# EAGLE design board (EAGLE 9.4.2)
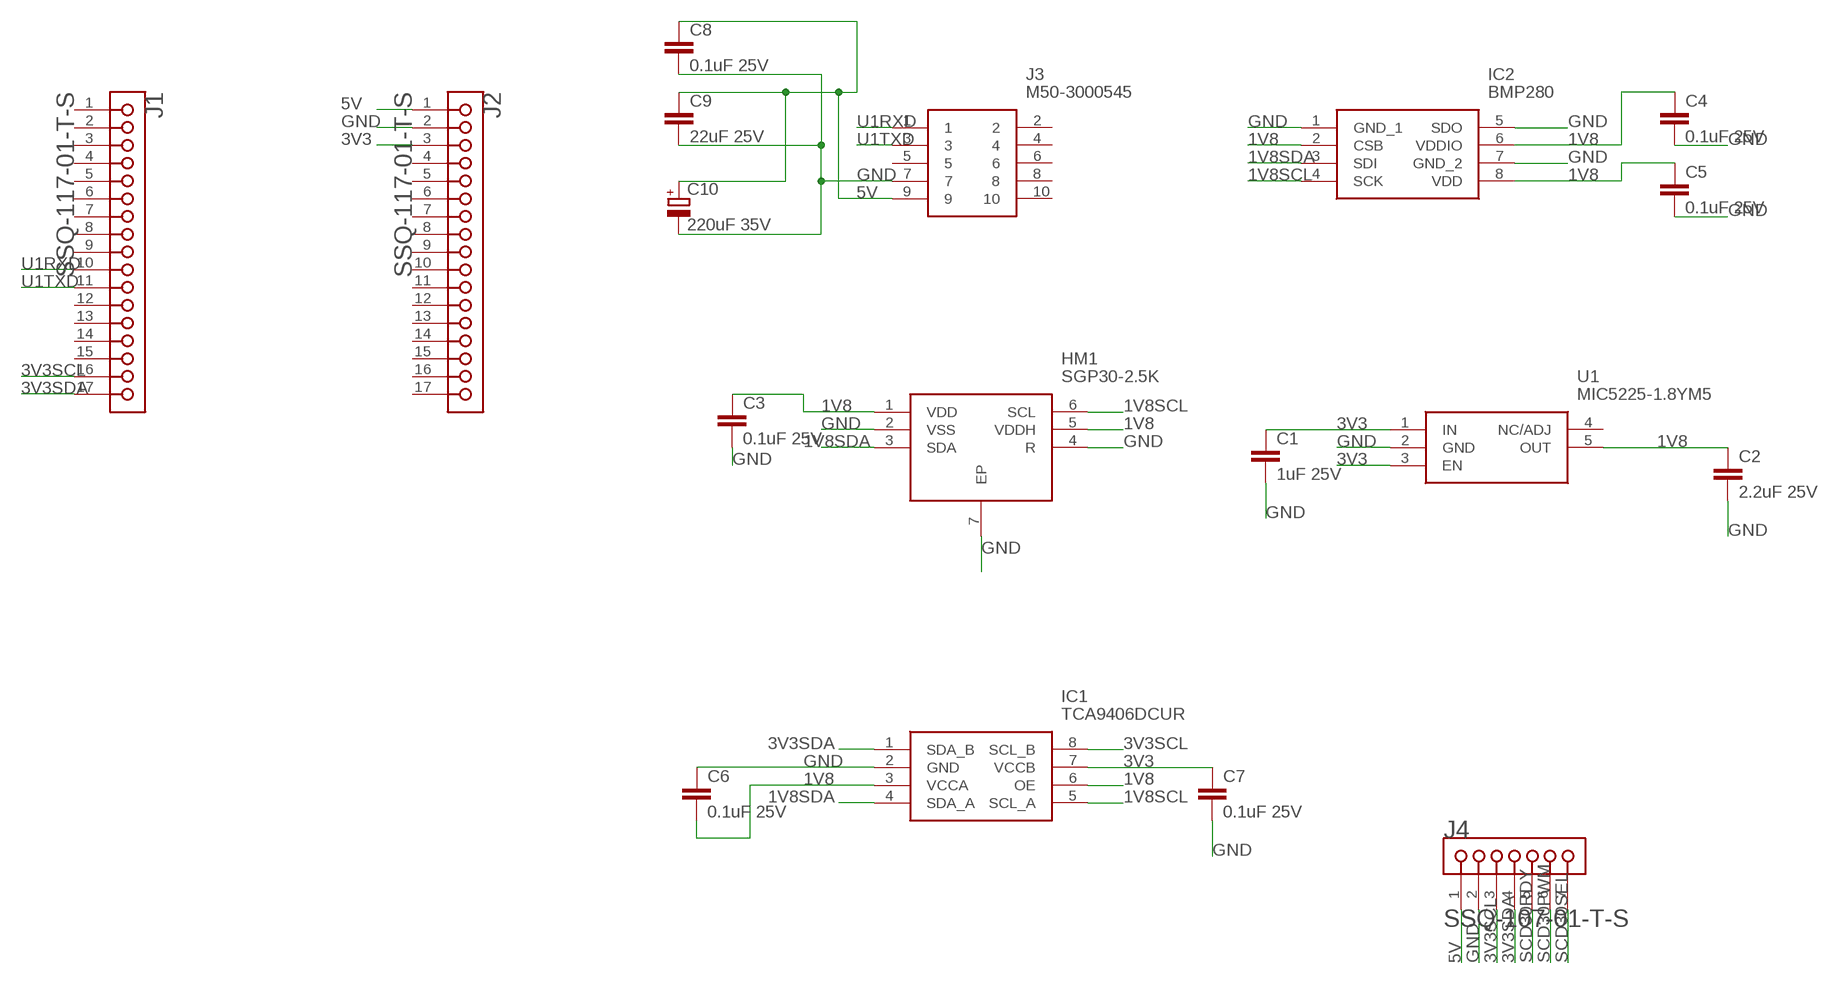
[diagram p0: schematic, sheet 1]

## Parts
C1  1uF 25V  C-EUC0402  [C0402]
C2  2.2uF 25V  C-EUC0402  [C0402]
C3  0.1uF 25V  C-EUC0402  [C0402]
C4  0.1uF 25V  C-EUC0402  [C0402]
C5  0.1uF 25V  C-EUC0402  [C0402]
C6  0.1uF 25V  C-EUC0402  [C0402]
C7  0.1uF 25V  C-EUC0402  [C0402]
C8  0.1uF 25V  C-EUC0402  [C0402]
C9  22uF 25V  C-EUC0805  [C0805]
C10  220uF 35V  CPOL-EUE5-10.5  [E5-10,5]
HM1  SGP30-2.5K  [SON80P245X245X90-7N]
IC1  TCA9406DCUR  [SOP50P310X90-8N]
IC2  BMP280  [8-PIN-METAL-LID-LGA_1]
J1  SAMTEC_SSQ-117-01-T-SSAMTEC_SSQ-117-01-T-S_0_0  [SAMTEC_SSQ-117-01-T-S_0]
J2  SAMTEC_SSQ-117-01-T-SSAMTEC_SSQ-117-01-T-S_0_0  [SAMTEC_SSQ-117-01-T-S_0]
J3  M50-3000545  [SHDR10W40P127X127_2X5_675X310X]
J4  SAMTEC_SSQ-107-01-T-SSAMTEC_SSQ-107-01-T-S_0_0  [SAMTEC_SSQ-107-01-T-S_0]
U1  MIC5225-1.8YM5  [SOT95P280X145-5N]

## Nets
1V8: C2.1 C3.1 C4.1 C5.1 C6.2 HM1.1(VDD) HM1.5(VDDH) IC1.3(VCCA) IC1.6(OE) IC2.2(CSB) IC2.6(VDDIO) IC2.8(VDD) U1.5(OUT)
1V8SCL: HM1.6(SCL) IC1.5(SCL_A) IC2.4(SCK)
1V8SDA: HM1.3(SDA) IC1.4(SDA_A) IC2.3(SDI)
3V3: C1.1 C7.1 IC1.7(VCCB) J2.3 U1.1(IN) U1.3(EN)
3V3SCL: IC1.8(SCL_B) J1.16 J4.3
3V3SDA: IC1.1(SDA_B) J1.17 J4.4
5V: C8.1 C9.1 C10.+ J2.1 J3.9 J4.1
GND: C1.2 C2.2 C3.2 C4.2 C5.2 C6.1 C7.2 C8.2 C9.2 C10.- HM1.2(VSS) HM1.4(R) HM1.7(EP) IC1.2(GND) IC2.1(GND_1) IC2.5(SDO) IC2.7(GND_2) J2.2 J3.7 J4.2 U1.2(GND)
SCD30PWM: J4.6
SCD30RDY: J4.5
SCD30SEL: J4.7
U1RXD: J1.10 J3.1
U1TXD: J1.11 J3.3
Unconnected: J1.1 J1.2 J1.3 J1.4 J1.5 J1.6 J1.7 J1.8 J1.9 J1.12 J1.13 J1.14 J1.15 J2.4 J2.5 J2.6 J2.7 J2.8 J2.9 J2.10 J2.11 J2.12 J2.13 J2.14 J2.15 J2.16 J2.17 J3.2 J3.4 J3.5 J3.6 J3.8 J3.10 U1.4(NC/ADJ)

## Library data of the parts
C1-C9 = rcl:C-EU: CAPACITOR, European symbol; SPICEPREFIX: C
C10 = rcl:CPOL-EU: POLARIZED CAPACITOR, European symbol; SPICEPREFIX: C
HM1 = SamacSys_Parts:SGP30-2.5K: AIR QUALITY GAS SENSOR FOR VOC'S Source: Datasheet <https://www.sensirion.com/fileadmin/user_upload/customers/sensirion/Dokumente/0_Datasheets/Gas/Sensirion_Gas_Sensors_SGP30_Datasheet.pdf>; DESCRIPTION: AIR QUALITY GAS SENSOR FOR VOC'S; HEIGHT: 0.9mm; MANUFACTURER_NAME: Sensirion AG; MANUFACTURER_PART_NUMBER: SGP30-2.5K
IC1 = SamacSys_Parts:TCA9406DCUR: 2-Bit Bidirectional 1-MHz I2C Bus and SMBus Voltage-Level Shifter Source: Datasheet <http://www.ti.com/lit/ds/symlink/tca9406.pdf>; DESCRIPTION: 2-Bit Bidirectional 1-MHz I2C Bus and SMBus Voltage-Level Shifter; HEIGHT: 0.9mm; MANUFACTURER_NAME: Texas Instruments; MANUFACTURER_PART_NUMBER: TCA9406DCUR; MOUSER_PART_NUMBER: 595-TCA9406DCUR; MOUSER_PRICE-STOCK: https://www.mouser.com/Search/Refine.aspx?Keyword=595-TCA9406DCUR; RS_PART_NUMBER: 7300644P; RS_PRICE-STOCK: http://uk.rs-online.com/web/p/products/7300644P
IC2 = SamacSys_Parts:BMP280: Digital Pressure Sensor Source: Datasheet <https://ae-bst.resource.bosch.com/media/_tech/media/datasheets/BST-BMP280-DS001-19.pdf>; DESCRIPTION: Digital Pressure Sensor; HEIGHT: mm; MANUFACTURER_NAME: Bosch; MANUFACTURER_PART_NUMBER: BMP280; MOUSER_PART_NUMBER: 262-BMP280
J1 J2 = Samtec - SSQ-117-01-T-S:SAMTEC_SSQ-117-01-T-S: SMTC-SSQ-117-01-X-S; CIIVA_IDS: 677232; COMPONENT_LINK_1_DESCRIPTION: Manufacturer URL; COMPONENT_LINK_1_URL: http://www.samtec.com; COMPONENT_LINK_3_DESCRIPTION: Package Specification; COMPONENT_LINK_3_URL: http://www.samtec.com/documents/webfiles/cpdf/SSQ-1XX-XX-XXX-X-XX-XXX-XX-X-MKT.pdf; DATASHEET: http://www.samtec.com/documents/webfiles/pdf/SSQ_TH.PDF; DATASHEET_VERSION: F-214; FOOTPRINT_VARIANT_NAME_0: Manufacturer Recommended; IMPORTED: yes; IMPORTED_FROM: vault; IMPORT_TS: 1521843089; MF: Samtec; MOUNTING_TECHNOLOGY: Through-hole; MPN: SSQ-117-01-T-S; ORIENTATION: Vertical; PACKAGE: SSQ-117-01-X-S; PACKAGE_DESCRIPTION: Assembly, Socket Strip .025[0.64] SQ Tail; PACKAGE_VERSION: BD, 6/1987; PITCH: 2.54 mm; PREFIX: J; RELEASE_DATE: 1404374478; TEMPERATURE_RANGE: -55 to 105 degC; VAULT_GUID: 51F95605-9192-4547-9232-81F4C6069D77; VAULT_REVISION: 376056EE-73F5-4DE6-86FB-5D86034DD3DE
J3 = SamacSys_Parts:M50-3000545: 2x5way DIL PCT Vert Socket HARWIN 1.27mm Pitch 10 Way 2 Row Straight PCB Socket, Through Hole, Solder Termination Source: Datasheet <https://cdn.harwin.com/pdfs/M50-300.pdf>; ALLIED_NUMBER: R1052996; ALLIED_PRICE-STOCK: https://www.alliedelec.com/harwin-m50-3000545/R1052996/; DESCRIPTION: 2x5way DIL PCT Vert Socket HARWIN 1.27mm Pitch 10 Way 2 Row Straight PCB Socket, Through Hole, Solder Termination; HEIGHT: 4.55mm; MANUFACTURER_NAME: HARWIN; MANUFACTURER_PART_NUMBER: M50-3000545; MOUSER_PART_NUMBER: 855-M50-3000545; MOUSER_PRICE-STOCK: https://www.mouser.com/Search/Refine.aspx?Keyword=855-M50-3000545; RS_PART_NUMBER: 6810692P; RS_PRICE-STOCK: http://uk.rs-online.com/web/p/products/6810692P
J4 = Samtec - SSQ-107-01-T-S:SAMTEC_SSQ-107-01-T-S: SMTC-SSQ-107-01-X-S; CIIVA_IDS: 677242; COMPONENT_LINK_1_DESCRIPTION: Manufacturer URL; COMPONENT_LINK_1_URL: http://www.samtec.com; COMPONENT_LINK_3_DESCRIPTION: Package Specification; COMPONENT_LINK_3_URL: http://www.samtec.com/documents/webfiles/cpdf/SSQ-1XX-XX-XXX-X-XX-XXX-XX-X-MKT.pdf; DATASHEET: http://www.samtec.com/documents/webfiles/pdf/SSQ_TH.PDF; DATASHEET_VERSION: F-214; FOOTPRINT_VARIANT_NAME_0: Manufacturer Recommended; IMPORTED: yes; IMPORTED_FROM: vault; IMPORT_TS: 1521843739; MF: Samtec; MOUNTING_TECHNOLOGY: Through-hole; MPN: SSQ-107-01-T-S; ORIENTATION: Vertical; PACKAGE: SSQ-107-01-X-S; PACKAGE_DESCRIPTION: Assembly, Socket Strip .025[0.64] SQ Tail; PACKAGE_VERSION: BD, 6/1987; PITCH: 2.54 mm; PREFIX: J; RELEASE_DATE: 1404374450; TEMPERATURE_RANGE: -55 to 105 degC; VAULT_GUID: BEC2537B-EFAC-41A8-9E29-E20360AA1012; VAULT_REVISION: DFF8E92A-4A4C-49C4-BD9F-B28D4257A290
U1 = SamacSys_Parts:MIC5225-1.8YM5: Ultra-Low Quiescent Current 150mA uCap Low Dropout Regulator Source: Datasheet <http://www.mouser.com/ds/2/268/mic5225-1082288.pdf>; DESCRIPTION: Ultra-Low Quiescent Current 150mA uCap Low Dropout Regulator; HEIGHT: 1.45mm; MANUFACTURER_NAME: Micrel; MANUFACTURER_PART_NUMBER: MIC5225-1.8YM5

## Board
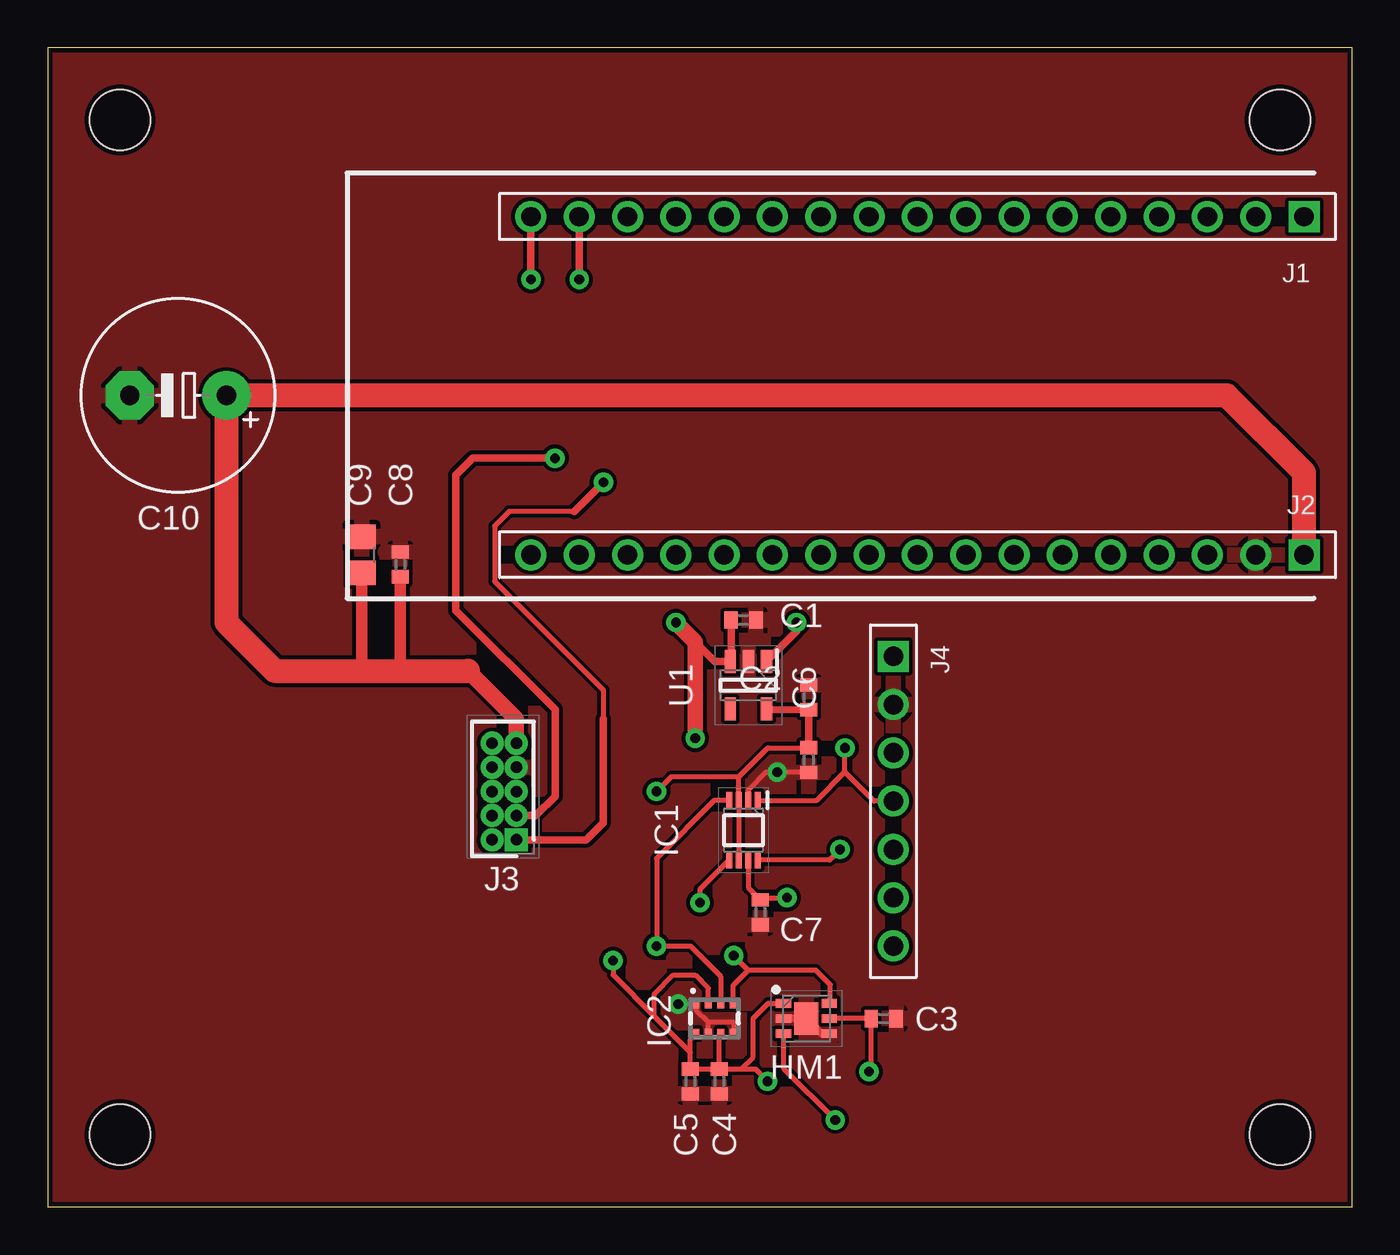
[diagram p1: board, top side]
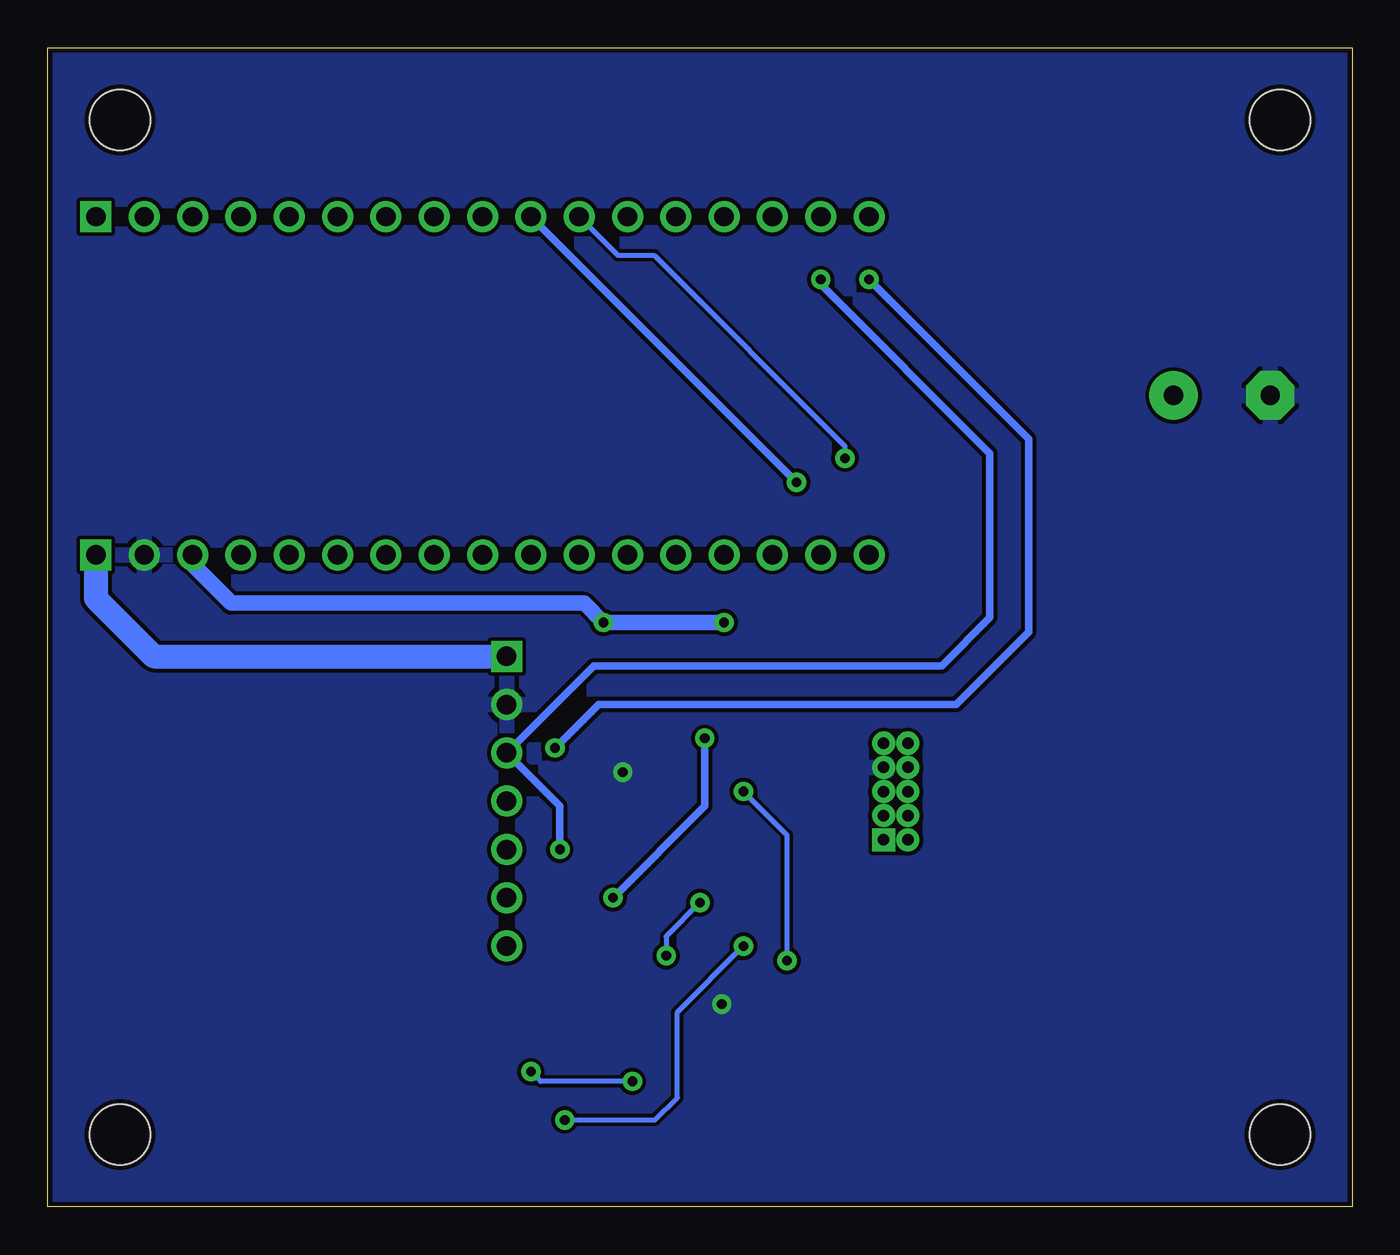
[diagram p2: board, bottom side, seen from below]

Size 68.58 x 60.96 mm. Coordinates in mm from the lower left corner, seen from the top.
Outline: 0,0 68.58,0 68.58,60.96 0,60.96 0,0
Copper layers (1*16): Top 0.035mm / dielectric 1.5mm / Bottom 0.035mm
Design rules "SparkFun": minimum track width 8mil, minimum drill 20mil, track to track 8mil, track to pad 8mil, pad to pad 8mil, via to via 8mil, smd to smd 8mil, copper to edge 10mil, drill to drill 8mil, minimum pad ring 12mil, minimum via ring 10mil, stop-mask expansion 4mil, vias tented up to drill 25mil, thermal gap 10mil
Holes 3.2 mm at 3.81,3.81 64.77,3.81 64.77,57.15 3.81,57.15

### Footprints (pad centres in the part's own frame; a part is rotated, then mirrored left to right if it is on the bottom)
C0402 = smd 0.7 x 0.9: 1 -0.65,0; 2 0.65,0
C0805 = smd 1.3 x 1.5: 1 -0.95,0; 2 0.95,0
E5-10,5 = drill 1.016 pad 2.54: + -2.54,0 | drill 1.016 pad 2.54 octagon: - 2.54,0
SON80P245X245X90-7N = smd 0.8 x 0.45: 1 -1.2,0.8; 2 -1.2,0; 3 -1.2,-0.8; 4 1.2,-0.8; 5 1.2,0; 6 1.2,0.8 | smd 1.25 x 1.7: 7 0,0
SOP50P310X90-8N = smd 0.85 x 0.3: 1 -1.575,0.75; 2 -1.575,0.25; 3 -1.575,-0.25; 4 -1.575,-0.75; 5 1.575,-0.75; 6 1.575,-0.25; 7 1.575,0.25; 8 1.575,0.75
8-PIN-METAL-LID-LGA_1 = smd 0.5 x 0.35: 1 0.8,0.975; 2 0.8,0.325; 3 0.8,-0.325; 4 0.8,-0.975; 5 -0.8,-0.975; 6 -0.8,-0.325; 7 -0.8,0.325; 8 -0.8,0.975
SAMTEC_SSQ-117-01-T-S_0 = drill 1.02 pad 1.55 square: 1 0,0 | drill 1.02 pad 1.55: 2 2.54,0; 3 5.08,0; 4 7.62,0; 5 10.16,0; 6 12.7,0; 7 15.24,0; 8 17.78,0; 9 20.32,0; 10 22.86,0; 11 25.4,0; 12 27.94,0; 13 30.48,0; 14 33.02,0; 15 35.56,0; 16 38.1,0; 17 40.64,0
SHDR10W40P127X127_2X5_675X310X = drill 0.6 pad 1 square: 1 0,0 | drill 0.6 pad 1: 2 0,1.27; 3 1.27,0; 4 1.27,1.27; 5 2.54,0; 6 2.54,1.27; 7 3.81,0; 8 3.81,1.27; 9 5.08,0; 10 5.08,1.27
SAMTEC_SSQ-107-01-T-S_0 = drill 1.02 pad 1.55 square: 1 0,0 | drill 1.02 pad 1.55: 2 2.54,0; 3 5.08,0; 4 7.62,0; 5 10.16,0; 6 12.7,0; 7 15.24,0
SOT95P280X145-5N = smd 1.2 x 0.6: 1 -1.25,0.95; 2 -1.25,0; 3 -1.25,-0.95; 4 1.25,-0.95; 5 1.25,0.95

### Placement (x,y rotation side)
C1  36.58,30.86 0 top
C2  40.01,26.8 90 top
C3  43.94,9.91 0 top
C4  35.31,6.6 270 top
C5  33.78,6.6 270 top
C6  40.01,23.5 90 top
C7  37.47,15.49 270 top
C8  18.54,33.78 90 top
C9  16.51,34.29 90 top
C10  6.86,42.67 180 top
HM1  39.88,9.91 0 top
IC1  36.58,19.81 270 top
IC2  35.05,9.91 90 top
J1  66.04,52.07 180 top
J2  66.04,34.29 180 top
J3  24.64,19.3 90 top
J4  44.45,28.96 270 top
U1  36.83,27.43 270 top

### Tracks (layer width: path | path; a pad name or v marks a point on that pad's centre or on a via)
1V8  (via drill 0.51)
  Top 0.254: IC1.6 IC1.3 36.33,22.61 | IC2.2 34.73,11.5 34.04,12.19 32.89,12.19 31.88,11.18 31.88,10.03 | C6.2 37.86,24.14 36.33,22.61 | HM1.5 C3.1 43.29,7.22 v43.18,7.11 | C4.1 C5.1 33.78,8.13 | C4.1 35.31,9.04 IC2.6 | 33.78,8.13 33.78,8.81 IC2.8 | 33.78,8.13 31.88,10.03 | C4.1 36.46,7.25 | 36.46,7.25 37.08,7.87 37.08,9.91 37.88,10.71 HM1.1 | 36.46,7.25 37.2,7.25 v37.85,6.6 | 36.33,22.61 32.77,22.61 v32,21.84 | v29.72,12.95 29.72,12.19 31.88,10.03
  Top 0.406: U1.5 arc-90 37.83,26.13 C2.1 C6.2
  Bottom 0.254: v37.85,6.6 42.67,6.6 v43.18,7.11 | v32,21.84 29.72,19.56 v29.72,12.95
1V8SCL  (via drill 0.51)
  Top 0.254: IC2.4 36.03,11.64 36.83,12.45 | HM1.6 41.15,10.78 41.15,11.68 40.39,12.45 36.83,12.45 | IC1.5 34.29,16.7 v34.29,16 | v36.07,13.21 36.83,12.45
  Bottom 0.254: v34.29,16 36.07,14.22 v36.07,13.21
1V8SDA  (via drill 0.51)
  Top 0.254: IC1.4 35.05,21.39 32,18.34 v32,13.72 33.78,13.72 35.38,12.12 IC2.3 | HM1.3 38.68,7.3 v41.4,4.57
  Bottom 0.254: v32,13.72 35.48,10.24 35.48,5.75 36.66,4.57 v41.4,4.57
3V3  (via drill 0.51)
  Top 0.254: v38.86,16.26 37.58,16.26 arc90 C7.1 36.83,16.78 IC1.7
  Top 0.406: C1.1 35.93,28.73 arc-90 U1.3 35.07,28.68 34.04,29.72 | U1.1 39.37,30.27 v39.37,30.73
  Top 0.813: v33.02,30.73 34.04,29.72 v34.04,24.64
  Bottom 0.406: v34.04,24.64 34.04,21.08 v38.86,16.26
  Bottom 0.813: v33.02,30.73 v39.37,30.73 40.39,31.75 58.93,31.75 60.96,33.78 J2.3
3V3SCL  (via drill 0.51)
  Top 0.254: v41.66,18.8 41.1,18.24 IC1.8
  Top 0.406: J1.16 v27.94,48.77
  Bottom 0.406: v41.66,18.8 41.66,21.08 J4.3 39.88,28.45 21.59,28.45 19.05,30.99 19.05,39.62 27.94,48.51 v27.94,48.77
3V3SDA  (via drill 0.51)
  Top 0.254: IC1.1 40.44,21.39 41.91,22.86 | 41.91,22.86 v41.91,24.13 | J4.4 43.43,21.34 41.91,22.86
  Top 0.406: J1.17 v25.4,48.77
  Bottom 0.406: v25.4,48.77 17.02,40.39 17.02,30.23 20.83,26.42 39.62,26.42 v41.91,24.13
5V
  Top 0.61: C9.1 16.51,28.19 | C8.1 18.54,28.19
  Top 0.813: J3.9 24.64,25.65 22.1,28.19
  Top 1.27: 22.1,28.19 18.54,28.19 16.51,28.19 11.94,28.19 9.4,30.73 C10.+ 61.98,42.67 66.04,38.61 J2.1
  Bottom 1.27: J2.1 66.04,32 62.99,28.96 J4.1
GND  (via drill 0.51)
  Top 0.254: IC2.7 34.73,9.72 | 34.73,9.72 34.08,10.37 IC2.1 34.04,10.67 v33.15,10.67 | 34.73,9.72 36,9.72 36.07,9.65 36.07,9.15 IC2.5 | IC1.2 36.83,21.93 37.76,22.86 v38.35,22.86 39.99,22.86 C6.1
  Top 0.406: HM1.4 40.68,9.11 HM1.7 HM1.2
  pour Top: 0,60.96 0,0 68.58,0 68.58,60.96
  pour Bottom: 0,60.96 0,0 68.58,0 68.58,60.96
U1RXD  (via drill 0.51)
  Top 0.254: 27.69,36.58 24.26,36.58 23.5,35.81 23.5,32.89 29.21,27.18 29.21,25.65
  Top 0.406: v29.21,38.1 27.69,36.58 | 29.21,25.65 29.21,20.19 28.32,19.3 J3.1
  Bottom 0.406: J1.10 v29.21,38.1
U1TXD  (via drill 0.51)
  Top 0.406: v26.67,39.37 22.35,39.37 21.46,38.48 21.46,31.37 26.67,26.16 26.67,21.59 25.65,20.57 J3.3
  Bottom 0.254: J1.11 38.61,50.04 36.7,50.04 26.67,40.01 v26.67,39.37